# Altium project New Member Design Project.PrjPcb
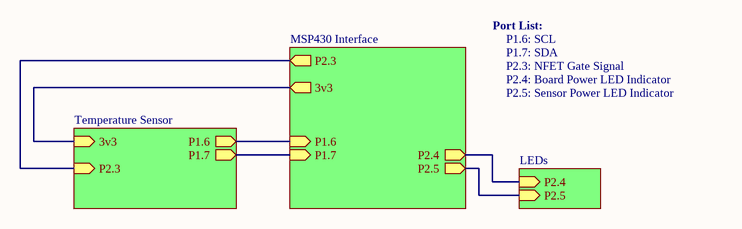
[diagram p0: NMP Schematic.SchDoc]
4 sheets, 9 parts. Net scope: hierarchical (ports join the sheet entries above them; power ports are global).
Board file: PCB.PcbDoc
Sheets:
  NMP Schematic.SchDoc
    MSP430 Interface = Launchpad Header.SchDoc
    Temperature Sensor = Temperature Sensor.SchDoc
    LEDs = Status LEDs.SchDoc

## Sheet NMP Schematic.SchDoc
size A

### Sub-sheets
LEDs = Status LEDs.SchDoc: P2.4 (in), P2.5 (in)
MSP430 Interface = Launchpad Header.SchDoc: P2.4 (out), P2.5 (out), P1.6 (in), P1.7 (in), P2.3 (out), 3v3 (out)
Temperature Sensor = Temperature Sensor.SchDoc: P1.6 (out), P1.7 (out), 3v3 (in), P2.3 (in)

### Nets
LED_SENSE1: sheet MSP430 Interface/P2.5, sheet LEDs/P2.5
LED_VCC1: sheet MSP430 Interface/P2.4, sheet LEDs/P2.4
NFET_GATE1: sheet MSP430 Interface/P2.3, sheet Temperature Sensor/P2.3
SCL: sheet MSP430 Interface/P1.6, sheet Temperature Sensor/P1.6
SDA: sheet MSP430 Interface/P1.7, sheet Temperature Sensor/P1.7
VCC: sheet MSP430 Interface/3v3, sheet Temperature Sensor/3v3

### Notes on the sheet
- Port List:
- P1.6: SCL
- P1.7: SDA
- P2.3: NFET Gate Signal
- P2.4: Board Power LED Indicator
- P2.5: Sensor Power LED Indicator

## Sheet Launchpad Header.SchDoc
size A
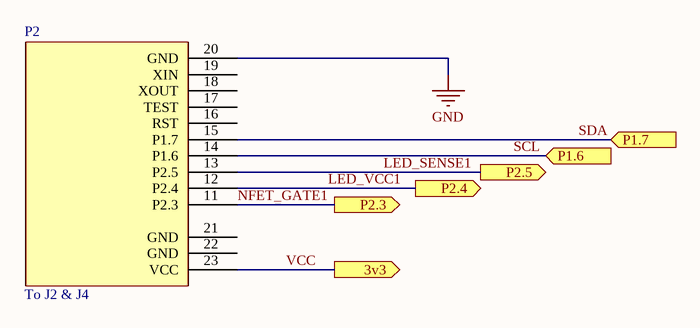
[diagram p1: Launchpad Header.SchDoc]

### Parts
P2  To J2 & J4  [MSP-EXP430G2 Mating Headers for J2/J4]

### Ports
3v3 (out), P1.6 (in), P1.7 (in), P2.3 (out), P2.4 (out), P2.5 (out)

### Nets
GND: P2.20(GND)
LED_SENSE1: P2.13(P2.5) ; port P2.5
LED_VCC1: P2.12(P2.4) ; port P2.4
NFET_GATE1: P2.11(P2.3) ; port P2.3
SCL: P2.14(P1.6) ; port P1.6
SDA: P2.15(P1.7) ; port P1.7
VCC: P2.23(VCC) ; port 3v3

Not connected (* = marked no-connect by the designer): P2 16(RST) 17(TEST) 18(XOUT) 19(XIN) 21(GND) 22(GND)

### Library data of the parts
P2 = MSP-EXP430G2 Mating Headers for J2/J4: Female Mating Headers for MSP-EXP430G2 J2 & J4 / (can use Würth Elektronik 61301011121 and 61300311121); Manufacturer: URC; Manufacturer Part Number: N/A; Value: N/A

## Sheet Temperature Sensor.SchDoc
size A
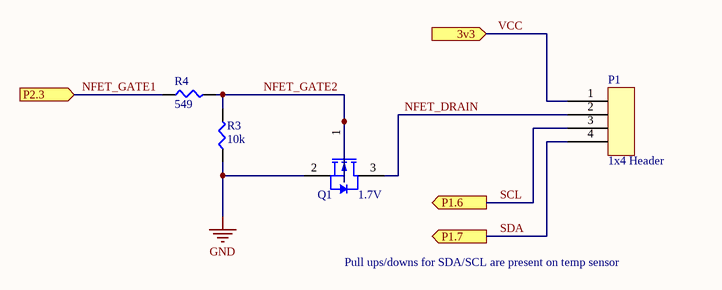
[diagram p2: Temperature Sensor.SchDoc]

### Parts
P1  1x4 Header  [1X4 HEADER]
Q1  1.7V  [FAIR-SOT23-3_V]
R3  10k  [SMD-0805-RES]
R4  549  [SMD-0805-RES]

### Ports
3v3 (in), P1.6 (out), P1.7 (out), P2.3 (in)

### Nets
GND: Q1.2(S) R3.1
NFET_DRAIN: P1.2 Q1.3(D)
NFET_GATE1: R4.1 ; port P2.3
NFET_GATE2: Q1.1(G) R3.2 R4.2
SCL: P1.3 ; port P1.6
SDA: P1.4 ; port P1.7
VCC: P1.1 ; port 3v3

### Notes on the sheet
- Pull ups/downs for SDA/SCL are present on temp sensor

### Library data of the parts
P1 = 1X4 HEADER: CONN HEADER VERT 4POS 2.54MM; Manufacturer: Würth Elektronik; Manufacturer Part Number: 61300411121; Value: 1x4 Header
Q1 = CMP-2000-04934-1: N-Channel Logic Level Enhancement Mode Field Effect Transistor, 1.7 V, -55 to 150 degC, 3-Pin SOT-23, RoHS, Tape and Reel; Manufacturer: Fairchild; Manufacturer Part Number: BSS123; Channel Type: N; Typical Turn-Off Delay Time: 17ns; Maximum Continuous Drain Current: 0.17A; Rad Hard: No; Typical Rise Time: 9ns; Typical Fall Time: 2.4ns; Maximum Gate Source Voltage: ±20V; Maximum Drain Source Voltage: 100V; Typical Turn-On Delay Time: 1.7ns; RDS-on: 6000@10VmOhm; Package Version: Rev. 12, 03/2016; Packaging: Tape&Reel; Package Reference: SOT23-3; Channel Mode: Enhancement; Operating Temperature: -55to150degC; Package Description: 3-Pin Small Outline Transistor, Body 2.92 x 1.325 mm, Pitch 0.95 mm; Category: MOSFET; Datasheet Version: Jun-03; Datasheet URL: https://www.fairchildsemi.com/datasheets/BS/BSS123.pdf; Manufacturer URL: https://www.fairchildsemi.com/; Mounting: SurfaceMount; Package: 3SOT-23; Package URL: http://www.fairchildsemi.com/dwg/MA/MA03D.pdf; Value: 1.7 V
R3 = ERJ-P06F1002V: RES SMD 10K OHM 1% 1/2W 0805; Manufacturer: Panasonic Electronic Components; Unit Price (USD): 0.02534; Minimum Quantity: 1; Power (Watts): 0.5W, 1/2W; Temperature Coefficient: ±100ppm/°C; Part Number: ERJ-P06F1002V; Datasheets: https://industrial.panasonic.com/cdbs/www-data/pdf/RDA0000/AOA0000C243.pdf; Image: //media.digikey.com/Renders/Panasonic%20Renders/ERJ-0805%20Pkg.jpg; Digi-Key Part Number: P16059CT-ND; Quantity Available: 42054; Packaging: Cut Tape (CT); Series: ERJ; Part Status: Active; Value: 10k; Tolerance: ±1%; Composition: Thick Film; Features: Automotive AEC-Q200, Pulse Withstanding; Operating Temperature: -55°C ~ 155°C; Package / Case: 0805 (2012 Metric); Supplier Device Package: 0805; Size / Dimension: 0.079" L x 0.049" W (2.00mm x 1.25mm); Height - Seated (Max): 0.028" (0.70mm); Number of Terminations: 2; Failure Rate: -; Manufacturer Part Number: ERJ-P06F1002V
R4 = ERJ-6ENF5490V: RES SMD 549 OHM 1% 1/8W 0805; Manufacturer: Panasonic Electronic Components; Unit Price (USD): 0.00729; Minimum Quantity: 1; Power (Watts): 0.125W, 1/8W; Temperature Coefficient: ±100ppm/°C; Part Number: ERJ-6ENF5490V; Datasheets: http://industrial.panasonic.com/www-cgi/jvcr13pz.cgi?E+PZ+3+AOA0002+ERJ6ENF5490V+7+WW; Image: //media.digikey.com/Renders/Panasonic%20Renders/ERJ-0805%20Pkg.jpg; Digi-Key Part Number: P549CCT-ND; Quantity Available: 49191; Packaging: Cut Tape (CT); Series: ERJ; Part Status: Active; Value: 549; Tolerance: ±1%; Composition: Thick Film; Features: Automotive AEC-Q200; Operating Temperature: -55°C ~ 155°C; Package / Case: 0805 (2012 Metric); Supplier Device Package: 0805; Size / Dimension: 0.079" L x 0.049" W (2.00mm x 1.25mm); Height - Seated (Max): 0.028" (0.70mm); Number of Terminations: 2; Failure Rate: -; Manufacturer Part Number: ERJ-6ENF5490V

## Sheet Status LEDs.SchDoc
size A
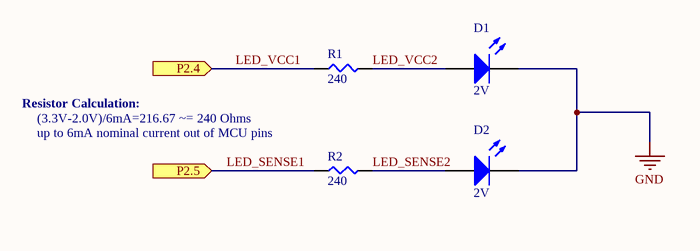
[diagram p3: Status LEDs.SchDoc]

### Parts
D1  2V  [0805_A]
D2  2V  [0805_A]
R1  240  [SMD-0805-RES]
R2  240  [SMD-0805-RES]

### Ports
P2.4 (in), P2.5 (in)

### Nets
GND: D1.1(K) D2.1(K)
LED_SENSE1: R2.1 ; port P2.5
LED_SENSE2: D2.2(A) R2.2
LED_VCC1: R1.1 ; port P2.4
LED_VCC2: D1.2(A) R1.2

### Notes on the sheet
- Resistor Calculation:
- (3.3V-2.0V)/6mA=216.67 ~= 240 Ohms
- (near R2) up to 6mA nominal current out of MCU pins

### Library data of the parts
D1 D2 = CMP-1426-00009-1: SMD mono-color Chip LED, WL-SMCW, Bright Green; PartNumber: 150080VS75000; Manufacturer: Wuerth Elektronik; ComponentLink1Description: Manufacturer URL; Color: Bright Green; PackageReference: 0805_A; ComponentLink1URL: http://www.we-online.com; ComponentLink2Description: Datasheet; ComponentLink2URL: http://katalog.we-online.com/led/datasheet/150080VS75000.pdf; Manufacturer Part Number: 150080VS75000; Value: 2V
R1 R2 = ERJ-6ENF2400V: RES SMD 240 OHM 1% 1/8W 0805; Manufacturer: Panasonic Electronic Components; Unit Price (USD): 0.00729; Minimum Quantity: 1; Power (Watts): 0.125W, 1/8W; Temperature Coefficient: ±100ppm/°C; Part Number: ERJ-6ENF2400V; Datasheets: http://industrial.panasonic.com/www-cgi/jvcr13pz.cgi?E+PZ+3+AOA0002+ERJ6ENF2400V+7+WW; Image: //media.digikey.com/Renders/Panasonic%20Renders/ERJ-0805%20Pkg.jpg; Digi-Key Part Number: P240CCT-ND; Quantity Available: 62802; Packaging: Cut Tape (CT); Series: ERJ; Part Status: Active; Value: 240; Tolerance: ±1%; Composition: Thick Film; Features: Automotive AEC-Q200; Operating Temperature: -55°C ~ 155°C; Package / Case: 0805 (2012 Metric); Supplier Device Package: 0805; Size / Dimension: 0.079" L x 0.049" W (2.00mm x 1.25mm); Height - Seated (Max): 0.028" (0.70mm); Number of Terminations: 2; Failure Rate: -; Manufacturer Part Number: ERJ-6ENF2400V

## Nets that join several sheets
GND: Launchpad Header (P2.20), Temperature Sensor (Q1.2 R3.1), Status LEDs (D1.1 D2.1)
LED_SENSE1: Launchpad Header (P2.13), Status LEDs (R2.1)
LED_VCC1: Launchpad Header (P2.12), Status LEDs (R1.1)
NFET_GATE1: Launchpad Header (P2.11), Temperature Sensor (R4.1)
SCL: Launchpad Header (P2.14), Temperature Sensor (P1.3)
SDA: Launchpad Header (P2.15), Temperature Sensor (P1.4)
VCC: Launchpad Header (P2.23), Temperature Sensor (P1.1)